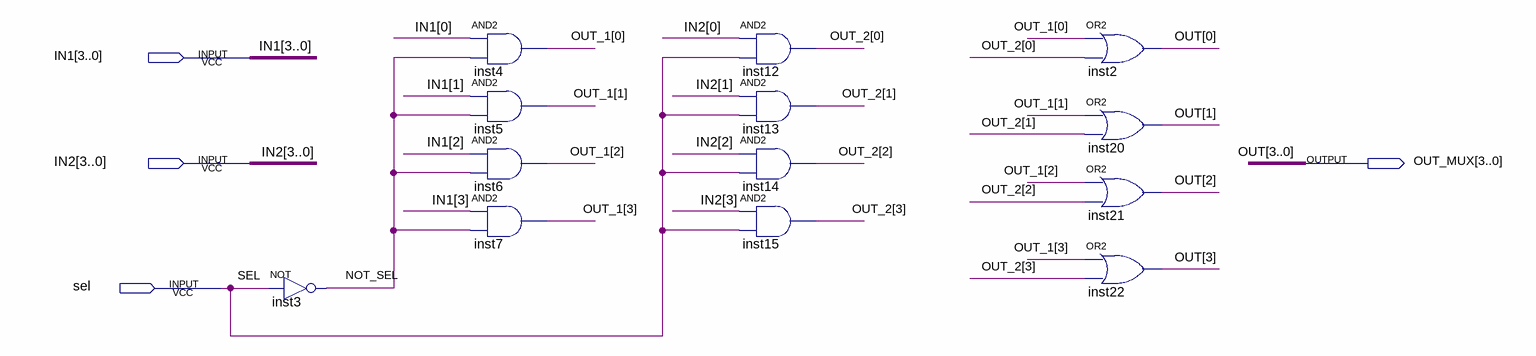
[diagram p0: schematic sheet]
// Quartus schematic MUX_4_BIT.bdf as structural Verilog: 13 symbols, 4 pins
module MUX_4_BIT (
  input  [3:0] IN1,
  input  [3:0] IN2,
  input  sel,
  output [3:0] OUT_MUX
);

  wire NOT_SEL;
  wire [3:0] OUT_1, OUT_2;

  not inst3 (NOT_SEL, sel);
  and inst4 (OUT_1[0], IN1[0], NOT_SEL);
  and inst5 (OUT_1[1], IN1[1], NOT_SEL);
  and inst6 (OUT_1[2], IN1[2], NOT_SEL);
  and inst7 (OUT_1[3], IN1[3], NOT_SEL);
  and inst12 (OUT_2[0], IN2[0], sel);
  and inst13 (OUT_2[1], IN2[1], sel);
  and inst14 (OUT_2[2], IN2[2], sel);
  and inst15 (OUT_2[3], IN2[3], sel);
  or inst2 (OUT_MUX[0], OUT_1[0], OUT_2[0]);
  or inst20 (OUT_MUX[1], OUT_1[1], OUT_2[1]);
  or inst21 (OUT_MUX[2], OUT_1[2], OUT_2[2]);
  or inst22 (OUT_MUX[3], OUT_1[3], OUT_2[3]);

  // Other names for the same wires on the sheet: OUT[3:0] = OUT_MUX
endmodule
